# EAGLE design MicrocontrollerCircuitV2 (EAGLE 8.4.1)
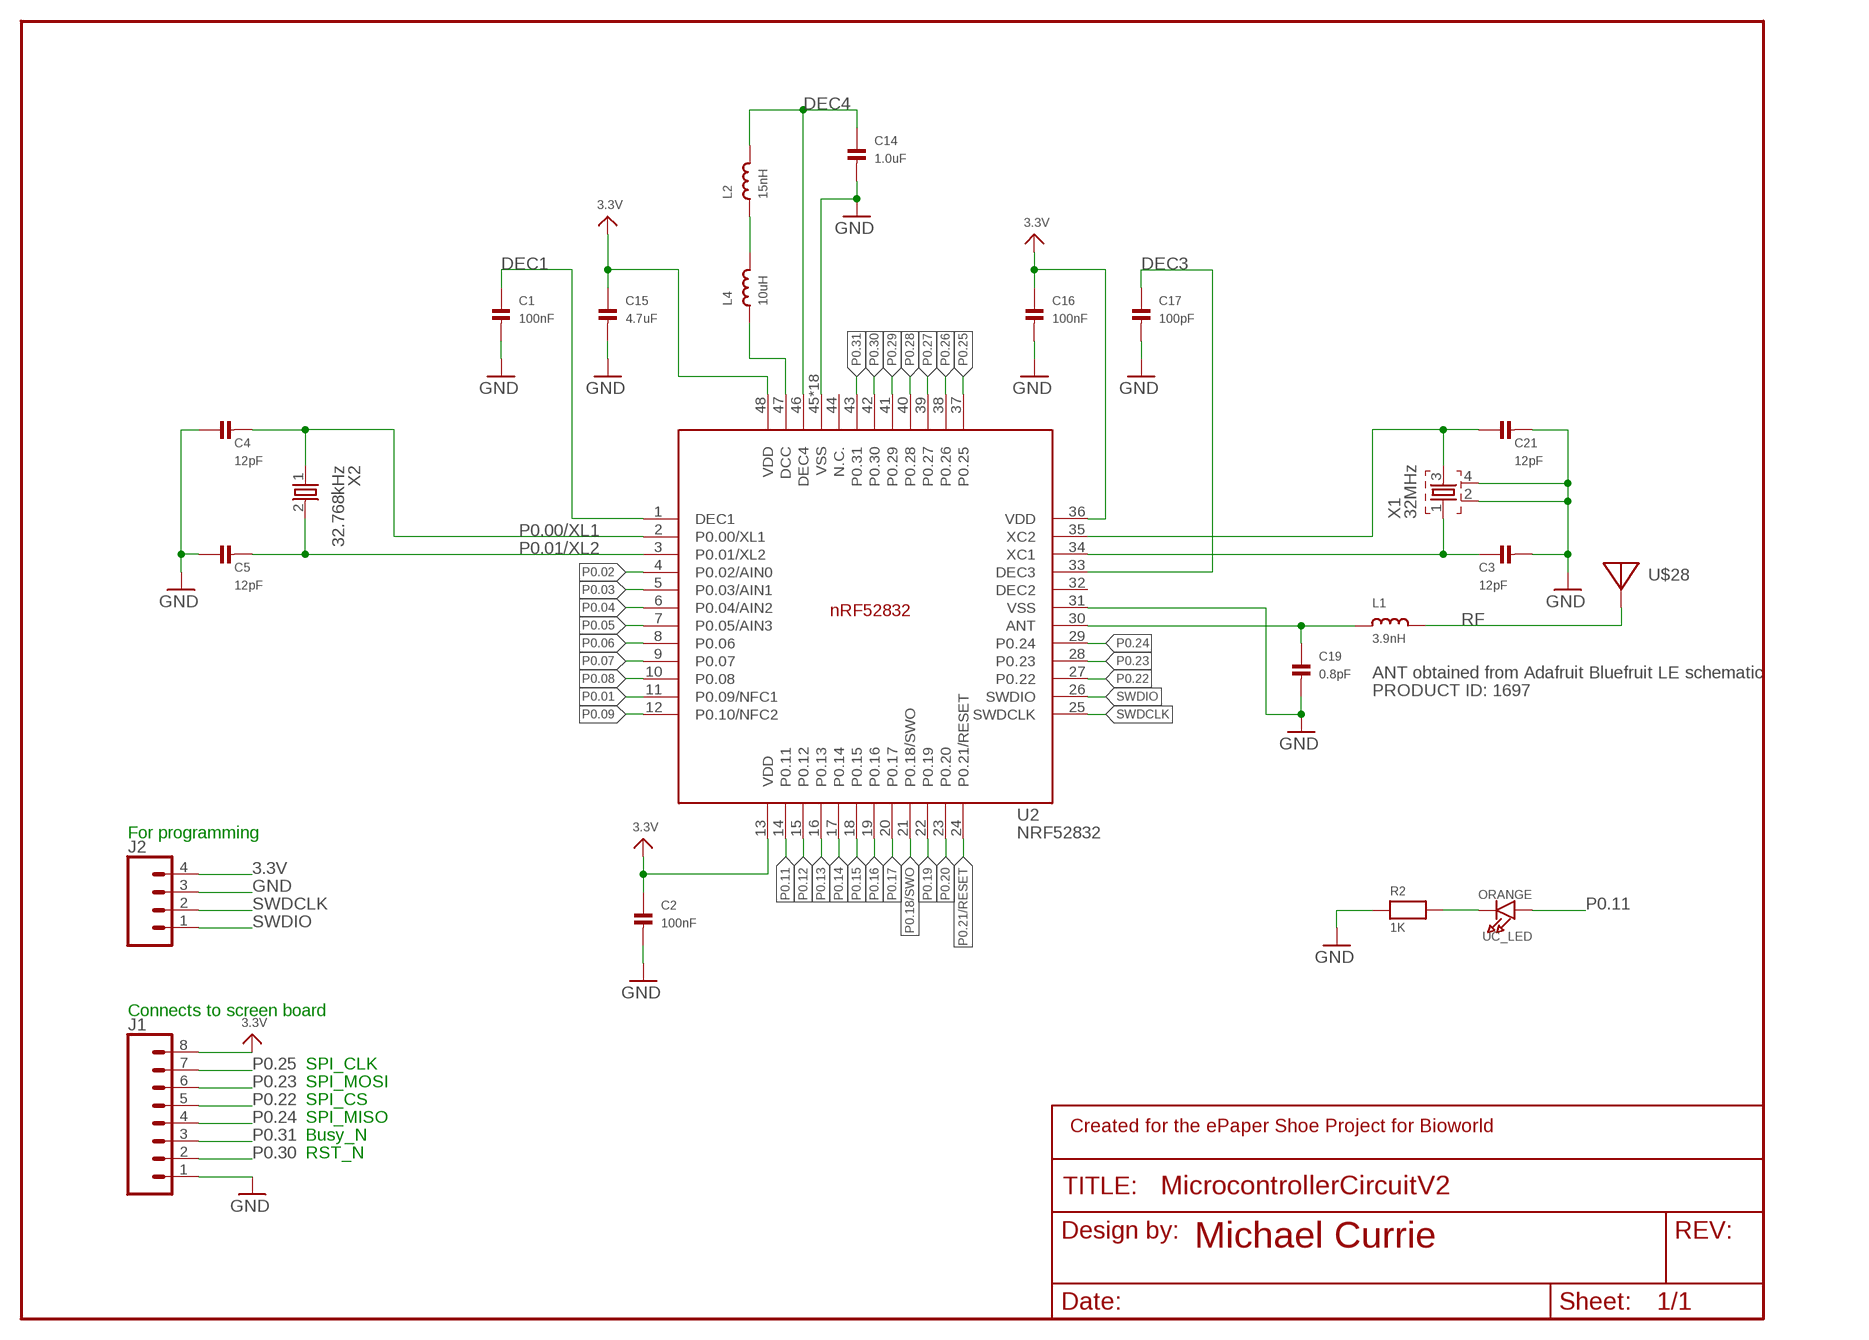
[diagram p0: schematic, sheet 1]

## Parts
C1  100nF  CAP_CERAMIC0805  [0805]
C2  100nF  CAP_CERAMIC0805  [0805]
C3  12pF  CAP_CERAMIC0805  [0805]
C4  12pF  CAP_CERAMIC0805  [0805]
C5  12pF  CAP_CERAMIC0805  [0805]
C14  1.0uF  CAP_CERAMIC0805  [0805]
C15  4.7uF  CAP_CERAMIC0805  [0805]
C16  100nF  CAP_CERAMIC0805  [0805]
C17  100pF  CAP_CERAMIC0805  [0805]
C19  0.8pF  CAP_CERAMIC0805  [0805]
C21  12pF  CAP_CERAMIC0805  [0805]
FRAME2  FRAME-LETTER-MICHAELNO_PACKAGE  [DUMMY]
J1  CONN_08"  [1X08]
J2  CONN_04  [1X04]
L1  3.9nH  INDUCTOR0805  [0805]
L2  15nH  INDUCTOR0805  [0805]
L4  10uH  INDUCTOR0805  [0805]
R2  1K  RESISTOR0805  [0805]
U2  NRF52832  [QFN40P600X600X90-48_N]
U$28  ANTENNA_PCBNRF8001_1.6MM  [ANT_PCB_2.4GHZ_NRF8001_1.6MM_1OZ]
UC_LED  ORANGE  LED0805_NOOUTLINE  [CHIPLED_0805_NOOUTLINE]
X1  32MHz  XTAL_32MHZ  [BT-XTAL_2016_N]
X2  32.768kHz  XTAL_32KHZ  [XTAL_3215_N]

## Nets
3.3V: C2.1 C15.1 C16.1 J1.8 J2.4 U2.13(VDD) U2.36(VDD) U2.48(VDD)
ANT: C19.1 L1.1 U2.30(ANT)
DEC1: C1.1 U2.1(DEC1)
DEC3: C17.1 U2.33(DEC3)
DEC4: C14.1 L2.2 U2.46(DEC4)
GND: C1.2 C2.2 C3.2 C4.1 C5.1 C14.2 C15.2 C16.2 C17.2 C19.2 C21.2 J1.1 J2.3 R2.1 U2.31(VSS) U2.45(VSS) U2.PAD(VSS) U2.PAD@VIA01(VSS) U2.PAD@VIA02(VSS) U2.PAD@VIA03(VSS) U2.PAD@VIA04(VSS) U2.PAD@VIA05(VSS) U2.PAD@VIA06(VSS) U2.PAD@VIA07(VSS) U2.PAD@VIA08(VSS) U2.PAD@VIA09(VSS) U2.PAD@VIA10(VSS) U2.PAD@VIA11(VSS) U2.PAD@VIA12(VSS) U2.PAD@VIA13(VSS) U2.PAD@VIA14(VSS) U2.PAD@VIA15(VSS) U2.PAD@VIA16(VSS) X1.2 X1.4
N$1: L2.1 L4.2
N$3: C21.1 U2.35(XC2) X1.3
N$5: L4.1 U2.47(DCC)
N$15: R2.2 UC_LED.C
P0.00/XL1: C4.2 U2.2(P0.00/XL1) X2.1
P0.01: U2.11(P0.09/NFC1)
P0.01/XL2: C5.2 U2.3(P0.01/XL2) X2.2
P0.02: U2.4(P0.02/AIN0)
P0.03: U2.5(P0.03/AIN1)
P0.04: U2.6(P0.04/AIN2)
P0.05: U2.7(P0.05/AIN3)
P0.06: U2.8(P0.06)
P0.07: U2.9(P0.07)
P0.08: U2.10(P0.08)
P0.09: U2.12(P0.10/NFC2)
P0.11: U2.14(P0.11) UC_LED.A
P0.12: U2.15(P0.12)
P0.13: U2.16(P0.13)
P0.14: U2.17(P0.14)
P0.15: U2.18(P0.15)
P0.16: U2.19(P0.16)
P0.17: U2.20(P0.17)
P0.18/SWO: U2.21(P0.18/SWO)
P0.19: U2.22(P0.19)
P0.20: U2.23(P0.20)
P0.21/RESET: U2.24(P0.21/RESET)
P0.22: J1.5 U2.27(P0.22)
P0.23: J1.6 U2.28(P0.23)
P0.24: J1.4 U2.29(P0.24)
P0.25: J1.7 U2.37(P0.25)
P0.26: U2.38(P0.26)
P0.27: U2.39(P0.27)
P0.28: U2.40(P0.28)
P0.29: U2.41(P0.29)
P0.30: J1.2 U2.42(P0.30)
P0.31: J1.3 U2.43(P0.31)
RF: L1.2 U$28.FEED
SWDCLK: J2.2 U2.25(SWDCLK)
SWDIO: J2.1 U2.26(SWDIO)
X1: C3.1 U2.34(XC1) X1.1
Unconnected: U2.32(DEC2) U2.44(N.C.)

## Notes on the sheet
- ANT obtained from Adafruit Bluefruit LE schematic
- PRODUCT ID: 1697
- For programming
- Connects to screen board
- SPI_CLK
- SPI_MOSI
- SPI_CS
- SPI_MISO
- Busy_N
- RST_N

## Library data of the parts
C1-C5 C14-C17 C19 C21 = microbuilder:CAP_CERAMIC: Ceramic Capacitors 0402 - 0402 Surface Mount Capacitors 16pF 50V 5% [Digikey: 445-4899-2-ND] 18pF 50V 5% [Digikey: 490-1281-2-ND] 22pF 50V 5% [Digikey: 490-1283-2-ND] 68pF 50V 5% [Digikey: 490-1289-2-ND] 0.1uF 10V 10% [Digikey: 490-1318-2-ND] 1.0uF 6.3V 10% [Digikey: 490-1320-2-ND] 0603 - 0603 Surface Mount Capacitors 16 pF 50V 5% [Digikey: 445-5051-2-ND] 22 pF 50V [Digikey: PCC220ACVTR-ND] 33 pF 50V 5% [Digikey: 490-1415-1-ND] 56pF 50V 5% [Digikey: 490-1421-1-ND] 220pF 50V 5% [Digikey: 445-1285-1-ND] 680 pF 50V 2200 pF 50V 5% C0G [Digikey: 445-1297-1-ND] 5600 pF 100V 5% X7R [Digikey: 478-3711-1-ND] 0.1 µF 25V 10% [Digikey: PCC2277TR-ND] 0.22 µF 16V 10% X7R [Digikey: 445-1318-1-ND] 1.0 µF 25V 10% [Digikey: 445-5146-2-ND] 0603 - RF Specific 3pF 250V +/-0.1pF RF [Digikey: 712-1347-1-ND] 18 pF 250V 5% [Digikey: 478-3505-1-ND or 712-1322-1-ND] 56 pF 250V 5% C0G RF [Digikey: 490-4867-1-ND] 68 pF 250V RF [Digikey: 490-4868-1-ND] 0805 - 0805 Surface Mount Capacitors 220 pF 250V 2% RF Ceramic Capacitor [Digikey: 712-1398-1-ND] 1000 pF 50V 2% NP0 Ceramic Capacitor [Digikey: 478-3760-1-ND] 0.1 µF 25V 10% Ceramic Capacitor [Digikey: PCC1828TR-ND] 1.0 µF 16V 10% Ceramic Capacitor[Digikey: 490-1691-2-ND] 10.0 µF 10V 10% Ceramic Capacitor[Digikey: 709-1228-1-ND] 10.0 uF 16V 10% Ceramic Capacitor [Digikey: 478-5165-2-ND] 47 uF 6.3V 20% Ceramic Capacitor [Digikey: 587-1779-1-ND or 399-5506-1-ND] 1206 - 1206 Surface Mount Capacitors 47uF 10V 20% Ceramic Capacitor [Digikey: 490-5528-1-ND or 399-5508-1-ND or 445-6010-1-ND] 100uF 6.3V -20%, +80% Y5V Ceramic Capacitor (Digikey: 490-4512-1-ND, Mouser: 81-GRM31CF50J107ZE1L)
FRAME2 = SparkFun-Aesthetics:FRAME-LETTER-MICHAEL: Schematic Frame - Letter Standard 8.5x11 US Letter frame; DESIGNER: Nobody; VERSION: v01
J1 = SparkFun-Connectors:CONN_08: Multi connection point. Often used as Generic Header-pin footprint for 0.1 inch spaced/style header connections On any of the 0.1 inch spaced packages, you can populate with these: Break Away Headers - Straight <https://www.sparkfun.com/products/116> (PRT-00116) Break Away Male Headers - Right Angle <https://www.sparkfun.com/products/553> (PRT-00553) Female Headers <https://www.sparkfun.com/products/115> (PRT-00115) Break Away Headers - Machine Pin <https://www.sparkfun.com/products/117> (PRT-00117) Break Away Female Headers - Swiss Machine Pin <https://www.sparkfun.com/products/743> (PRT-00743) Arduino Stackable Header - 8 Pin <https://www.sparkfun.com/products/9279> (PRT-09279) For SCREWTERMINALS and SPRING TERMINALS visit here: Screw Terimnals on SparkFun.com <https://www.sparkfun.com/search/results?term=Screw+Terminals> (5mm/3.5mm/2.54mm spacing) This device is also useful as a general connection point to wire up your design to another part of your project. Our various solder wires solder well into these plated through hole pads. Hook-Up Wire - Assortment (Stranded, 22 AWG) <https://www.sparkfun.com/products/11375> (PRT-11375) Hook-Up Wire - Assortment (Solid Core, 22 AWG) <https://www.sparkfun.com/products/11367> (PRT-11367) View the entire wire category on our website here <https://www.sparkfun.com/categories/141> Special notes: Molex polarized connector foot print use with SKU : PRT-08231 with associated crimp pins and housings. 1MM SMD Version SKU: PRT-10208 NOTES ON THE VARIANTS LOCK and LOCK_LONGPADS... This footprint was designed to help hold the alignment of a through-hole component (i.e. 6-pin header) while soldering it into place. You may notice that each hole has been shifted either up or down by 0.005 of an inch from it's more standard position (which is a perfectly straight line). This slight alteration caused the pins (the squares in the middle) to touch the edges of the holes. Because they are alternating, it causes a "brace" to hold the component in place. 0.005 has proven to be the perfect amount of "off-center" position when using our standard breakaway headers. Although looks a little odd when you look at the bare footprint, once you have a header in there, the alteration is very hard to notice. Also,if you push a header all the way into place, it is covered up entirely on the bottom side.; PROD_ID: CONN-08438
J2 = SparkFun-Connectors:CONN_04: Multi connection point. Often used as Generic Header-pin footprint for 0.1 inch spaced/style header connections On any of the 0.1 inch spaced packages, you can populate with these: Break Away Headers - Straight <https://www.sparkfun.com/products/116> (PRT-00116) Break Away Male Headers - Right Angle <https://www.sparkfun.com/products/553> (PRT-00553) Female Headers <https://www.sparkfun.com/products/115> (PRT-00115) Break Away Headers - Machine Pin <https://www.sparkfun.com/products/117> (PRT-00117) Break Away Female Headers - Swiss Machine Pin <https://www.sparkfun.com/products/743> (PRT-00743) For SCREWTERMINALS and SPRING TERMINALS visit here: Screw Terimnals on SparkFun.com <https://www.sparkfun.com/search/results?term=Screw+Terminals> (5mm/3.5mm/2.54mm spacing) This device is also useful as a general connection point to wire up your design to another part of your project. Our various solder wires solder well into these plated through hole pads. Hook-Up Wire - Assortment (Stranded, 22 AWG) <https://www.sparkfun.com/products/11375> (PRT-11375) Hook-Up Wire - Assortment (Solid Core, 22 AWG) <https://www.sparkfun.com/products/11367> (PRT-11367) View the entire wire category on our website here <https://www.sparkfun.com/categories/141> Special notes: Molex polarized connector foot print use with SKU : PRT-08231 with associated crimp pins and housings. 1MM SMD Version SKU: PRT-10208; PROD_ID: CONN-09696
L1 L2 L4 = microbuilder:INDUCTOR: Inductors 0603: 10nH Ceramic Inductor - microwire antenna/RF (Digikey: 712-1434-2-ND) 0805: 560nH Ceramic Inductor - RF (Digikey: 553-1047-1-ND) 270nH Ceramic Inductor - Q = 40@250MHz, +-5%, 1 Ohm DC Resistance (Digikey: 535-10506-2-ND) 1007 (2518 Metric) SMT: 10µH 10% 250mOhm 820mA 1007 Inductor (Digikey: 587-2189-1-ND) 22µH 10% 500mOhm 580mA 1007 Inductor (Digikey: 587-2190-1-ND) 47µH 10% 950mOhm 420mA 1007 Inductor (Digikey: 587-2191-1-ND) 47µH 5% 100mOhm 1A 1008 Inductor (Digikey: 732-1816-1-ND) 5.0x5.0mm (Taiyo Yuden NR5040 Series) 6.8µH 20% 2.3A 64mOhm Inductor (Digikey: 587-2374-2-ND) 5.0x5.0mm (TDK VLC5045 Series) 4.7µH 20% 3.3A 34mOhm Inductor (Digikey: 445-6526-1-ND) 6.8µH 20% 2.7A 46mOhm Inductor (Digikey: 445-6527-1-ND) 6.0x6.0mm (TDK VLC6045 Series) 4.7µH 20% 3.8A 27mOhm Inductor (Digikey: 445-6538-2-ND) 6.8µH 20% 3A 41mOhm Inductor (Digikey: 445-6540-1-ND) 6.2µH 30% 2.2A 45mOhm Inductor (Digikey: SRR5028-6R2YCT-ND) - Not TDK VLC6045 but footprint should match 6.0x6.0mm (TDK SLF6045 Series) 6.8uH 30% 2A 33mOhm Inductor (Digikey: 445-4572-1-ND, Mouser: 810-SLF645T6R8N2R0PF)
R2 = microbuilder:RESISTOR: Resistors 0402 - 0402 Surface Mount Package 22 Ohm 1% 1/16W [Digikey: 311-22.0LRTR-ND] 33 Ohm 5% 1/16W 1.0K 5% 1/16W 1.5K 5% 1/16W 2.0K 1% 1/16W 10.0K 1% 1/16W [Digikey: 311-10.0KLRTR-ND] 10.0K 5% 1/16W [Digikey: RMCF0402JT10K0TR-ND] 12.1K 1% 1/16W [Digikey: 311-22.0LRTR-ND] 100.0K 5% 1/16W 0603 - 0603 Surface Mount Package 0 Ohm 1/10 Watt 1% Resistor 15 Ohm 1/10 Watt 1% Resistor 33 Ohm 1/10 Watt 1% Resistor 49.9 Ohm 1/10 Watt 1% Resistor 100 Ohm 1/10 Watt 1% Resistor 150 Ohm 1/10 Watt 1% Resistor 240 Ohm 1/10 Watt 1% Resistor 390 Ohm 1/10 Watt 1% Resistor 560 Ohm 1/10 Watt 1% Resistor 680 Ohm 1/10 Watt 1% Resistor 750 Ohm 1/10 Watt 1% Resistor 1.0K Ohm 1/10 Watt 1% Resistor 1.5K Ohm 1/10 Watt 1% Resistor 2.0K Ohm 1/10 Watt 1% Resistor 2.2K Ohm 1/10 Watt 1% Resistor 3.3K Ohm 1/10 Watt 1% Resistor 4.7K Ohm 1/10 Watt 1% Resistor 10.0K Ohm 1/10 Watt 1% Resistor 12.0K Ohm 1/10 Watt 1% Resistor 12.1K Ohm 1/10 Watt 1% Resistor 20.0K Ohm 1/10 Watt 1% Resistor 33.0K Ohm 1/10 Watt 1% Resistor 100.0K Ohm 1/10 Watt 1% Resistor 0805 - 0805 Surface Mount Package 0 Ohm 1/8 Watt 1% Resistor 33 Ohm 1/8 Watt 1% Resistor 100 Ohm 1/8 Watt 1% Resistor 150 Ohm 1/8 Watt 1% Resistor 200 Ohm 1/8 Watt 1% Resistor 240 Ohm 1/8 Watt 1% Resistor 330 Ohm 1/8 Watt 1% Resistor 390 Ohm 1/8 Watt 1% Resistor 470 Ohm 1/8 Watt 1% Resistor 1.0K Ohm 1/8 Watt 1% Resistor 1.5K Ohm 1/8 Watt 1% Resistor 2.0K Ohm 1/8 Watt 1% Resistor 4.7K Ohm 1/8 Watt 1% Resistor 5.1K Ohm 1/8 Watt 1% Resistor 5.6K Ohm 1/8 Watt 1% Resistor 10.0K Ohm 1/8 Watt 1% Resistor 22.0K Ohm 1/8 Watt 1% Resistor 33.0K Ohm 1/8 Watt 1% Resistor 100K Ohm 1/8 Watt 1% Resistor 1206 - 1206 Surface Mount Package 2012 - 2010 Surface Mount Package 0.11 Ohm 1/2 Watt 1% Resistor - Digikey: RHM.11UCT-ND
U2 = Nordic_nRF:NRF52832: nRF52832 Features Single chip, highly flexible, 2.4 GHz multi-protocol SoC 32-bit ARM Cortex-M4F Processor 1.7v to 3.6v operation 512kB flash + 64kB RAM Supports concurrent Bluetooth Smart/ANT protocol operation On-chip NFC tag for Out-of-Band (OOB) pairing Up to +4dBm output power -96dBm sensitivity, Bluetooth Smart Thread safe and run-time protected Event driven API On air compatible with nRF24L and nRF24AP series 2 data rates (2Mbps/1Mbps) PPI - maximum flexibility for power-efficient applications and code simplification Automated power management system with automatic power management of each peripheral Configurable I/O mapping for analog and digital I/O 3 x Master/Slave SPI 2 x Two-wire interface (I²C) UART (RTS/CTS) 3 x PWM AES HW encryption Real Time Counter (RTC) Digital microphone interface (PDM) On-chip balun Applications Internet of Things (IoT) Wearables SmartHome sensors Connected white goods Computer peripherals Voice-command smart remotes A4WP ‘Rezence’ wireless charging Beacons Sports and fitness sensors and hubs Connected health products Smart watches RC Toys Interactive games Building automation and sensor networks
U$28 = microbuilder:ANTENNA_PCB: Various pre-calculated PCB Antennas NRF8001 1.6mm 1Oz - 2.4GHz PCB antenna for 1.6mm PCBs with 1oz copper, double-sided boards (no GND plan beneath antenna). See nRF2740 production files for further information and impedance matching network. 868MHz/2.4GHz DUALBAND - Dual 868MHz and 2.4GHz centered antenna based on board #6 of the CC-ANTENNA-DK from Chipcon/TI
UC_LED = microbuilder:LED: LED 0603 - 0603 Surface Mount Package 2mA: Green LED - Low Power (3.9mcd, 2ma, 1.7Vf) - Digikey: 475-2709-2-ND Orange LED - Low Power (9.8mcd, 2ma, 1.8Vf) - Digikey: 475-1194-2-ND Red LED - Low Power (5mcd, 2ma, 1.8Vf) - Digikey: 475-1195-2-ND Yellow LED - Low Power (7mcd, 2ma, 1.8Vf) - Digikey: 475-1196-2-ND 5mA: Blue LED - Low Power (17mcd, 5ma, 2.9Vf) - Digikey: LNJ937W8CRACT-ND 0805 - 0805 Surface Mount Package 2mA: Red LED (8.8mcd, 2mA, 1.8Vf, Clear) - Low Power [Digikey: 475-2510-1-ND] Green LED (5mcd, 2mA, 1.8Vf, Clear) - Low Power [Digikey: 475-2730-1-ND] Yellow LED (11.3mcd, 2mA, 1.8Vf, Clear) - Low Power [Digikey: 475-2555-1-ND] 20mA: Red LED (104mcd, 20mA, Diffused) - LS R976 [Digikey: 475-1278-6-ND] Red LED (12mcd, 20mA, 2.0Vf, Clear) - APT2012EC [Digikey: 754-1128-1-ND] Green LED (15mcd, 20mA, 2.2Vf, Clear) - APT2012GC [Digikey: 754-1131-1-ND] Orange LED (160mcd, 20mA, 2.1Vf, Clear) - APT2012SECK [Digikey: 754-1130-1-ND] 1206 - 1206 Surface Mount Package Green LED (26mcd, 20mA, Diffused) - LG N971 [Digikey: 475-1407-6-ND] Red LED (15mcd, 20mA, Diffused) - LH N974 [Digikey: 475-1416-6-ND]
X1 = Nordic_nRF:XTAL_32MHZ
X2 = Nordic_nRF:XTAL_32KHZ

## Board
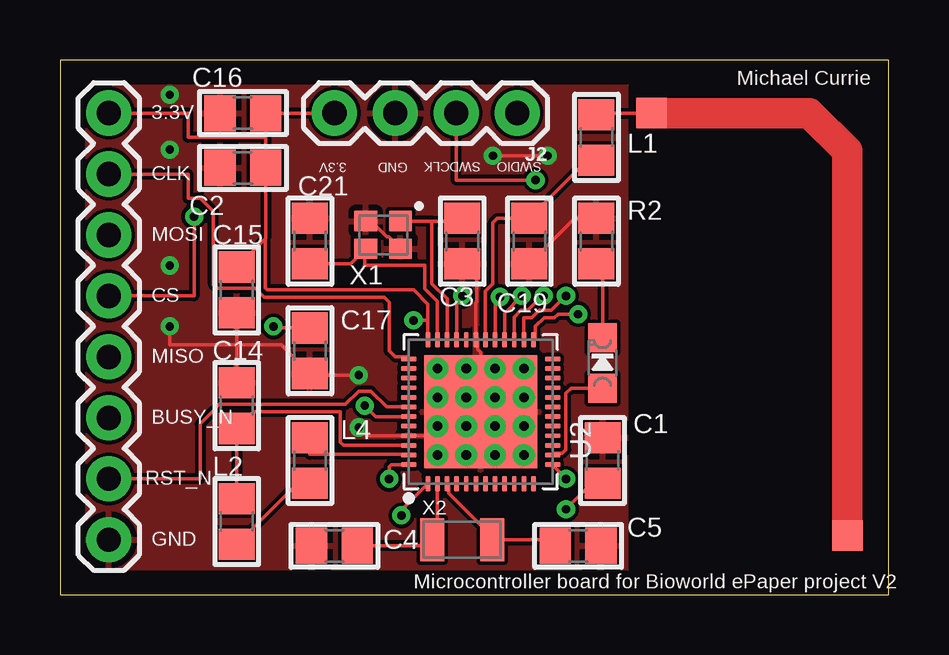
[diagram p1: board, top side]
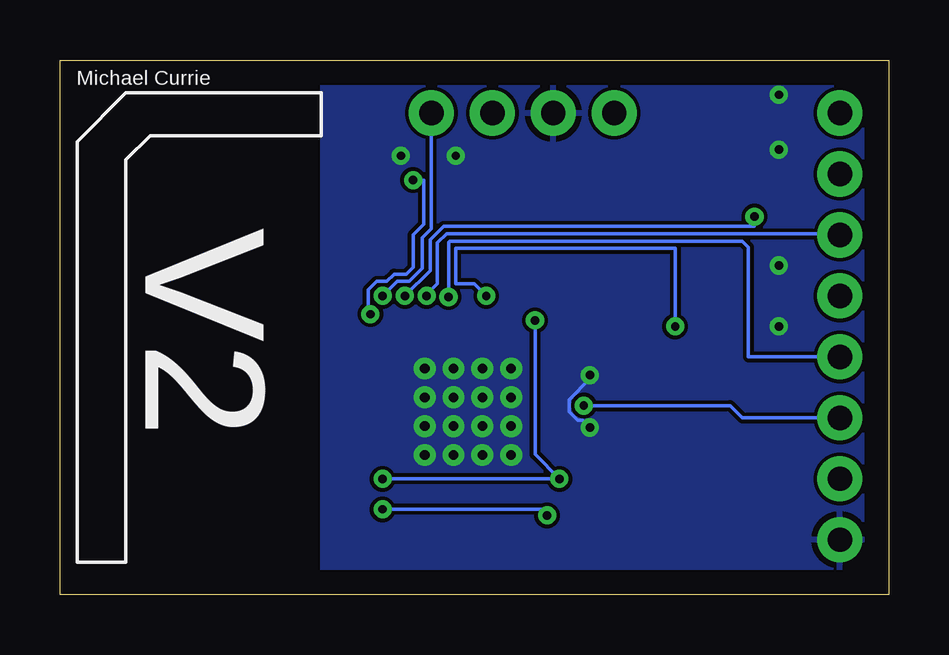
[diagram p2: board, bottom side, seen from below]

Size 34.52 x 22.28 mm. Coordinates in mm from the lower left corner, seen from the top.
Outline: 0,0 34.52,0 34.52,22.28 0,22.28 0,0
Copper layers (1*16): Top 0.035mm / dielectric 1.5mm / Bottom 0.035mm
Design rules "default": minimum track width 6mil, minimum drill 0.35mm, track to track 6mil, track to pad 6mil, pad to pad 6mil, via to via 6mil, smd to smd 6mil, copper to edge 40mil, drill to drill 6mil, minimum pad ring 10mil, minimum via ring 8mil, stop-mask expansion 4mil, vias tented up to drill 0mil, thermal gap 10mil

### Footprints (pad centres in the part's own frame; a part is rotated, then mirrored left to right if it is on the bottom)
0805 = smd 1.3 x 1.5: 1 -0.95,0; 2 0.95,0
1X08 = drill 1.016 pad 1.88: 1 0,0; 2 2.54,0; 3 5.08,0; 4 7.62,0; 5 10.16,0; 6 12.7,0; 7 15.24,0; 8 17.78,0
1X04 = drill 1.016 pad 1.88: 1 0,0; 2 2.54,0; 3 5.08,0; 4 7.62,0
QFN40P600X600X90-48_N = smd 0.65 x 0.2: 1 -3,2.2; 2 -3,1.8; 3 -3,1.4; 4 -3,1; 5 -3,0.6; 6 -3,0.2; 7 -3,-0.2; 8 -3,-0.6; 9 -3,-1; 10 -3,-1.4; 11 -3,-1.8; 12 -3,-2.2; 25 3,-2.2; 26 3,-1.8; 27 3,-1.4; 28 3,-1; 29 3,-0.6; 30 3,-0.2; 31 3,0.2; 32 3,0.6; 33 3,1; 34 3,1.4; 35 3,1.8; 36 3,2.2 | smd 0.2 x 0.65: 13 -2.2,-3; 14 -1.8,-3; 15 -1.4,-3; 16 -1,-3; 17 -0.6,-3; 18 -0.2,-3; 19 0.2,-3; 20 0.6,-3; 21 1,-3; 22 1.4,-3; 23 1.8,-3; 24 2.2,-3; 37 2.2,3; 38 1.8,3; 39 1.4,3; 40 1,3; 41 0.6,3; 42 0.2,3; 43 -0.2,3; 44 -0.6,3; 45 -1,3; 46 -1.4,3; 47 -1.8,3; 48 -2.2,3 | smd 4.7 x 4.7: PAD 0,0 | drill 0.4: PAD@VIA01 -1.8,1.8; PAD@VIA02 -1.8,0.6; PAD@VIA03 -1.8,-0.6; PAD@VIA04 -1.8,-1.8; PAD@VIA05 -0.6,1.8; PAD@VIA06 -0.6,0.6; PAD@VIA07 -0.6,-0.6; PAD@VIA08 -0.6,-1.8; PAD@VIA09 0.6,1.8; PAD@VIA10 0.6,0.6; PAD@VIA11 0.6,-0.6; PAD@VIA12 0.6,-1.8; PAD@VIA13 1.8,1.8; PAD@VIA14 1.8,0.6; PAD@VIA15 1.8,-0.6; PAD@VIA16 1.8,-1.8
ANT_PCB_2.4GHZ_NRF8001_1.6MM_1OZ = smd 1.27 x 1.27: FEED 0,0; TESTPOINT -8.169,17.605
CHIPLED_0805_NOOUTLINE = smd 1.2 x 1.2: A 0,-1.05; C 0,1.05
BT-XTAL_2016_N = smd 0.95 x 0.85: 1 -0.725,-0.575; 2 0.725,-0.575; 3 0.725,0.575; 4 -0.725,0.575
XTAL_3215_N = smd 1 x 1.8: 1 -1.25,0; 2 1.25,0

### Placement (x,y rotation side)
C1  22.61,5.59 90 top
C2  7.62,17.78 180 top
C3  16.76,14.73 270 top
C4  11.43,2.03 0 top
C5  21.59,2.03 180 top
C14  7.37,7.87 90 top
C15  7.37,12.7 270 top
C16  7.62,20.07 180 top
C17  10.41,10.16 270 top
C19  19.56,14.73 270 top
C21  10.41,14.73 90 top
FRAME2  -29.72,32.51 0 top  (outside the outline)
J1  2.03,2.29 90 top
J2  19.05,20.07 180 top
L1  22.35,19.05 90 top
L2  7.37,3.05 90 top
L4  10.41,5.59 270 top
R2  22.35,14.73 270 top
U2  17.53,7.62 90 top
U$28  24.64,20.07 180 top
UC_LED  22.61,9.65 0 top
X1  13.46,14.99 180 top
X2  16.76,2.29 0 top

### Tracks (layer width: path | path; a pad name or v marks a point on that pad's centre or on a via)
3.3V  (via drill 0.35)
  Top 0.152: 8.57,19.05 C16.1 J2.4 | 8.57,19.05 C2.1 8.57,14.85 8.54,14.83 | 8.54,14.83 C15.1 | 8.57,19.05 5.33,19.05 5.33,20.07 J1.8 | 15.33,11.43 U2.36 | 15.33,11.43 15.33,12.11 14.73,12.7 8.64,12.7 8.54,12.79 8.54,14.83 | U2.48 13.8,5.42 13.72,5.33 v13.72,4.83 | v14.73,11.43 15.33,11.43 | v21.08,4.83 20.53,5.38 U2.13
  Bottom 0.152: v14.73,11.43 14.73,5.84 v13.72,4.83 v21.08,4.83
ANT
  Top 0.152: L1.1 21.98,18.1 C19.1 18.22,15.68 18.03,15.49 18.03,12.95 17.73,12.65 U2.30
DEC1  (via drill 0.35)
  Top 0.152: U2.1 14.22,3.52 v14.22,3.3 | v21.08,3.56 22.16,4.64 C1.1
  Bottom 0.152: v14.22,3.3 14.48,3.56 v21.08,3.56
DEC3  (via drill 0.35)
  Top 0.152: U2.33 16.53,12.21 v16.76,12.45 | v8.89,11.18 8.96,11.11 C17.1
  Bottom 0.152: v16.76,12.45 17.27,12.95 18.03,12.95 18.03,14.43 8.89,14.43 v8.89,11.18
DEC4
  Top 0.152: U2.46 11.81,6.22 11.68,6.35 11.68,7.62 8.06,7.62 C14.1 L2.2
GND  (via drill 0.35)
  Top 0.152: U2.PAD U2.PAD@VIA10 U2.PAD@VIA14 17.53,8.82 | U2.PAD 17.53,8.82 | 17.53,8.82 U2.PAD@VIA15 | U2.PAD@VIA11 U2.PAD@VIA16 | U2.PAD@VIA11 U2.PAD@VIA12 | U2.PAD U2.PAD@VIA11 | U2.PAD 18.73,7.62 U2.PAD@VIA08 | U2.PAD U2.PAD@VIA07 U2.PAD@VIA03 | U2.PAD U2.PAD@VIA04 | U2.PAD 17.53,6.42 U2.PAD@VIA02 | U2.PAD U2.PAD@VIA01 | U2.PAD U2.PAD@VIA06 U2.PAD@VIA05 15.33,6.62 U2.45 12.79,6.62 v12.45,6.96 | U2.PAD 16.33,7.62 U2.PAD@VIA09 | U2.PAD U2.PAD@VIA13 | C16.2 6.67,19.36 | C19.2 21.46,15.68 R2.1 | U2.PAD 17.53,10.09 17.4,10.22 17.4,10.55 U2.31 17.33,12.15 17.37,12.2 17.37,13.18 C3.2 | X1.4 13.69,14.91 13.62,14.91 12.96,15.56 X1.2 | v12.45,9.14 10.48,9.14 C17.2 9.21,10.41 7.37,10.41 | v20.32,18.29 v18.03,18.29 | 7.37,10.41 4.57,10.41 v4.57,11.18 | 7.37,10.41 C15.2 | 7.37,10.41 C14.2
  Bottom 0.152: v12.45,6.96 12.75,7.27 12.95,7.27 13.31,7.62 13.31,8.12 12.45,8.99 v12.45,9.14
  other vias: 4.57,18.54 4.57,13.72 4.57,20.83
  pour Top: 23.62,22.35 23.62,0 0,0 0,22.35
  pour Bottom: 0.25,22.1 23.62,22.1 23.62,0 0.25,0
N$1
  Top 0.152: L2.1 9.91,4.64 L4.2
N$3
  Top 0.152: C21.1 12.11,13.78 X1.3 12.7,14.37 12.7,13.72 15.19,13.72 15.19,12.75 15.73,12.21 U2.35
N$5
  Top 0.152: U2.47 14.5,5.84 10.41,5.84 L4.1
N$15
  Top 0.152: R2.2 22.61,13.53 UC_LED.C
P0.00/XL1
  Top 0.152: U2.2 15.73,2.5 X2.1 15.26,2.03 C4.2
P0.01/XL2
  Top 0.152: U2.3 16.2,4.55 16.2,4.22 18.01,2.4 X2.2 20.39,2.29 C5.2
P0.11
  Top 0.152: U2.14 20.6,5.89 20.93,5.89 21.08,6.05 21.08,8.38 21.3,8.6 UC_LED.A
P0.22  (via drill 0.35)
  Top 0.152: U2.27 18.93,11.56 19.21,11.84 19.5,11.84 20.1,12.45 v20.15,12.45 | v5.59,15.75 5.59,12.45 J1.5
  Bottom 0.152: v20.15,12.45 19.1,13.5 19.1,14.78 18.54,15.34 5.59,15.34 v5.59,15.75
P0.23  (via drill 0.35)
  Top 0.152: U2.28 18.53,11.73 v19.25,12.45
  Bottom 0.152: v19.25,12.45 19.25,12.5 18.8,12.95 18.8,14.66 18.41,15.04 2.08,15.04 J1.6
P0.24  (via drill 0.35)
  Top 0.152: U2.29 18.13,12.19 v18.34,12.4
  Bottom 0.152: v18.34,12.4 18.34,14.68 18.29,14.73 6.1,14.73 5.84,14.48 5.84,9.91 J1.4
P0.25
  Top 0.152: U2.37 14.44,9.91 13.97,9.91 13.72,10.16 13.72,12.19 13.51,12.39 8.51,12.39 8.13,12.77 6.52,12.77 6.39,12.91 6.39,15.96 5.84,16.51 5.33,16.51 5.33,17.53 J1.7
P0.30
  Top 0.152: U2.42 13.61,7.82 12.95,8.48 12.45,8.48 11.89,7.93 6.64,7.93 6.39,7.67 6.39,7.66 5.84,7.11 5.84,4.83 J1.2
P0.31  (via drill 0.35)
  Top 0.152: U2.43 13.15,7.42 v12.7,7.87
  Bottom 0.152: v12.7,7.87 6.6,7.87 6.1,7.37 J1.3
RF
  Top 0.152: L1.2 22.16,20.07 U$28.FEED
SWDCLK  (via drill 0.35)
  Top 0.152: U2.25 19.81,10.71 19.81,11.18 20.17,11.53 20.6,11.53 20.75,11.68 v21.59,11.68 | v19.81,17.27 16.51,17.27 J2.2
  Bottom 0.152: v19.81,17.27 19.37,17.27 19.37,15.43 19.81,14.99 19.81,13.65 20.1,13.36 20.6,13.36 20.91,13.05 21.33,13.05 21.69,12.7 21.69,11.78 v21.59,11.68
SWDIO  (via drill 0.35)
  Top 0.152: U2.26 19.33,11.53 19.66,11.53 19.97,11.84 20.48,11.84 v21.08,12.45
  Bottom 0.152: v21.08,12.45 20.48,13.05 19.98,13.05 19.44,13.59 19.44,14.88 19.06,15.25 19.06,19.8 J2.1
X1
  Top 0.152: C3.1 16.64,15.56 15.49,15.56 | 15.49,15.56 X1.1 | U2.34 16.13,12.32 15.49,12.95 15.49,15.56

### Text on the board
tPlace: Michael Currie | 3.3V | 3.3V | GND | SWDCLK | SWDIO | CLK | MOSI | CS | MISO | BUSY_N | RST_N | GND | Microcontroller board for Bioworld ePaper project V2
bPlace: Michael Currie | V2